# Altium schematic sheet Driver-Sheet.SchDoc
size A4; DocumentNumber: 7; SheetNumber: 7; SheetTotal: 10
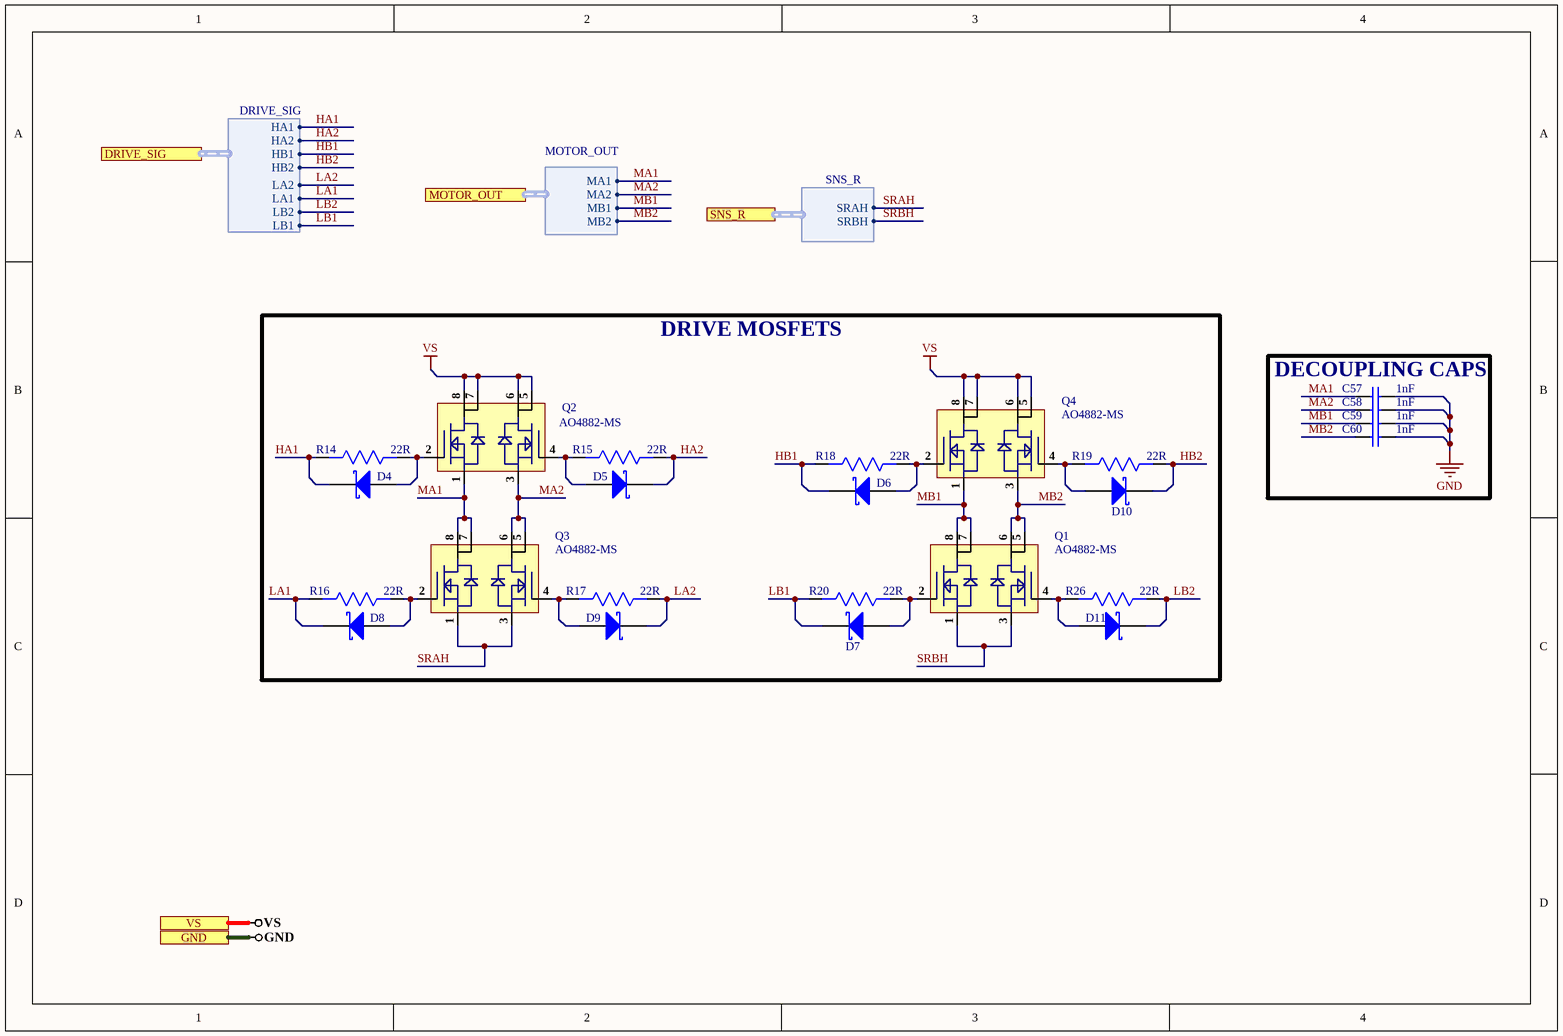
[diagram p0: Driver-Sheet.SchDoc]

## Parts
C57  1nF  [Cap 0603]
C58  1nF  [Cap 0603]
C59  1nF  [Cap 0603]
C60  1nF  [Cap 0603]
D4  CRS01(TE85L,Q,M)  [CRS01(TE85L,Q,M)]  (value not drawn)
D5  CRS01(TE85L,Q,M)  [CRS01(TE85L,Q,M)]  (value not drawn)
D6  CRS01(TE85L,Q,M)  [CRS01(TE85L,Q,M)]  (value not drawn)
D7  CRS01(TE85L,Q,M)  [CRS01(TE85L,Q,M)]  (value not drawn)
D8  CRS01(TE85L,Q,M)  [CRS01(TE85L,Q,M)]  (value not drawn)
D9  CRS01(TE85L,Q,M)  [CRS01(TE85L,Q,M)]  (value not drawn)
D10  CRS01(TE85L,Q,M)  [CRS01(TE85L,Q,M)]  (value not drawn)
D11  CRS01(TE85L,Q,M)  [CRS01(TE85L,Q,M)]  (value not drawn)
Q1  AO4882-MS  [AO4882-MS]
Q2  AO4882-MS  [AO4882-MS]
Q3  AO4882-MS  [AO4882-MS]
Q4  AO4882-MS  [AO4882-MS]
R14  22R  [Res0603]
R15  22R  [Res0603]
R16  22R  [Res0603]
R17  22R  [Res0603]
R18  22R  [Res0603]
R19  22R  [Res0603]
R20  22R  [Res0603]
R26  22R  [Res0603]

## Blocks framed on the sheet
DRIVE MOSFETS: D4-D11 Q1-Q4 R14-R20 R26
DECOUPLING CAPS: C57-C60

## Ports
DRIVE_SIG (harness DRIVE_SIG), GND, MOTOR_OUT (harness MOTOR_OUT), SNS_R (harness SNS_R), VS

## Harnesses
MOTOR_OUT: MA1, MA2, MB1, MB2
SNS_R: SRAH, SRBH
DRIVE_SIG: HA1, HA2, HB1, HB2, LA2, LA1, LB2, LB1

## Nets
GND: C57.2 C58.2 C59.2 C60.2 ; port GND
VS: Q2.5(D2) Q2.6(D2) Q2.7(D1) Q2.8(D1) Q4.5(D2) Q4.6(D2) Q4.7(D1) Q4.8(D1) ; port VS
HA1: D4.2(K) R14.2 ; port DRIVE_SIG.HA1
HA2: D5.2(K) R15.1 ; port DRIVE_SIG.HA2
HB1: D6.2(K) R18.2 ; port DRIVE_SIG.HB1
HB2: D10.2(K) R19.1 ; port DRIVE_SIG.HB2
LA1: D8.2(K) R16.2 ; port DRIVE_SIG.LA1
LA2: D9.2(K) R17.1 ; port DRIVE_SIG.LA2
LB1: D7.2(K) R20.2 ; port DRIVE_SIG.LB1
LB2: D11.2(K) R26.1 ; port DRIVE_SIG.LB2
MA1: C57.1 Q2.1(S1) Q3.7(D1) Q3.8(D1) ; port MOTOR_OUT.MA1
MA2: C58.1 Q2.3(S2) Q3.5(D2) Q3.6(D2) ; port MOTOR_OUT.MA2
MB1: C59.1 Q1.7(D1) Q1.8(D1) Q4.1(S1) ; port MOTOR_OUT.MB1
MB2: C60.1 Q1.5(D2) Q1.6(D2) Q4.3(S2) ; port MOTOR_OUT.MB2
SRAH: Q3.1(S1) Q3.3(S2) ; port SNS_R.SRAH
SRBH: Q1.1(S1) Q1.3(S2) ; port SNS_R.SRBH
NetD4_1: D4.1(A) Q2.2(G1) R14.1
NetD5_1: D5.1(A) Q2.4(G2) R15.2
NetD6_1: D6.1(A) Q4.2(G1) R18.1
NetD7_1: D7.1(A) Q1.2(G1) R20.1
NetD8_1: D8.1(A) Q3.2(G1) R16.1
NetD9_1: D9.1(A) Q3.4(G2) R17.2
NetD10_1: D10.1(A) Q4.4(G2) R19.2
NetD11_1: D11.1(A) Q1.4(G2) R26.2

## Library data of the parts
C57-C60 = CL10B102KC8NNNC: CAP CER 1nF 100V X7R 0603; Manufacturer: Samsung; Material: Ceramic; Tolerance: 10%; Supplier 1: Avnet; Manufacturer Part Number: CL10B102KC8NNNC; RoHS: Yes; Category: Ceramic Capacitors; Stock 1: 184000; Pricing 1: 4000=0.00988, 8000=0.00987, 16000=0.00986, 24000=0.00985, 32000=0.00984, 40000=0.00982, 400000=0.00981 (USD); Mount: Surface Mount; Case/Package: 0603; Case Code (Metric): 1608; Case Code (Imperial): 0603; Contact Plating: Tin; Min Operating Temperature: -55°C; Max Operating Temperature: 125°C; Capacitance: 1nF; Dielectric: X7R; Packaging: Tape and Reel; Package Quantity: 1; Voltage Rating: 100V; Voltage: 100V; Voltage Rating (DC): 100V; Series: CL; Construction: Flat; Length: 1.6mm; Width: 0.031inch; Height: 0.8mm; Thickness: 0.035inch; Depth: 0.8mm; Radiation Hardening: No; Lead Free: Lead Free; RoHS Compliant: Yes; ComponentLink1URL: https://datasheet.ciiva.com/25799/cl10b102kc8nnnc-25799476.pdf?src-supplier=Digi-Key; ComponentLink1Description: https://datasheet.ciiva.com/25799/cl10b102kc8nnnc-25799476.pdf?src-supplier=Digi-Key; ComponentLink2URL: https://datasheet.ciiva.com/29198/458286-da-01-en-vs-kondensator-0603-29198496.pdf?src-supplier=Conrad; ComponentLink2Description: https://datasheet.ciiva.com/29198/458286-da-01-en-vs-kondensator-0603-29198496.pdf?src-supplier=Conrad; ComponentLink3URL: https://datasheet.ciiva.com/26838/getdatasheetpartid-640779-26838395.pdf?src-supplier=Verical; ComponentLink3Description: https://datasheet.ciiva.com/26838/getdatasheetpartid-640779-26838395.pdf?src-supplier=Verical; ComponentLink4URL: https://datasheet.ciiva.com/26310/mlcc-catalogdownload2013-eng-26310266.pdf?src-supplier=Distrelec; ComponentLink4Description: https://datasheet.ciiva.com/26310/mlcc-catalogdownload2013-eng-26310266.pdf?src-supplier=Distrelec; ComponentLink5URL: https://datasheet.ciiva.com/16199/cl05b104kq5nnnc-16199246.pdf?src-supplier=Future+Electronics; ComponentLink5Description: https://datasheet.ciiva.com/16199/cl05b104kq5nnnc-16199246.pdf?src-supplier=Future+Electronics; Supplier Part Number 1: CL10B102KC8NNNC
D4-D11 = CRS01(TE85L,Q,M): DIODE SCHOTTKY 30V 1A SOD123F; Manufacturer: TOSHIBA; Supplier 1: Digi-Key; Manufacturer Part Number: CRS01(TE85L,Q,M); Stock 1: 72983
Q1-Q4 = AO4882-MS: 40V 6A 25mΩ@10V,6A 1.9W 1.6V@250uA 76pF@15V 2 N-Channel 1.013nF@15V 9.8nC@4.5V -55℃~+150℃@(Tj) SOP-8 MOSFETs ROHS; Manufacturer: MSKSEMI; Manufacturer Part Number: AO4882-MS; Footprint: SOP-8; ComponentLink1Description: LCSC; ComponentLink1URL: https://www.lcsc.com/product-detail/MOSFETs_MSKSEMI-AO4882-MS_C2847038.html
R14-R20 R26 = 0603WAF220JT5E: 22Ω 0603 Chip Resistor - Surface Mount ROHS; Manufacturer: UNI-ROYAL; ComponentLink1Description: LCSC; ComponentLink1URL: https://www.lcsc.com/product-detail/Chip-Resistor-Surface-Mount_UNI-ROYAL-Uniroyal-Elec-0603WAF220JT5E_C23345.html; Manufacturer Part Number: 0603WAF220JT5E; Footprint: 0603; Value: 22R